# EasyEDA schematic EasyEDA_Source_v2.e.json
TITLE: Juego; REV: v2.d; Date: 2022.09; Sheet: 1/1; Drawn By: bryan costanich; Company: Wilderness Labs
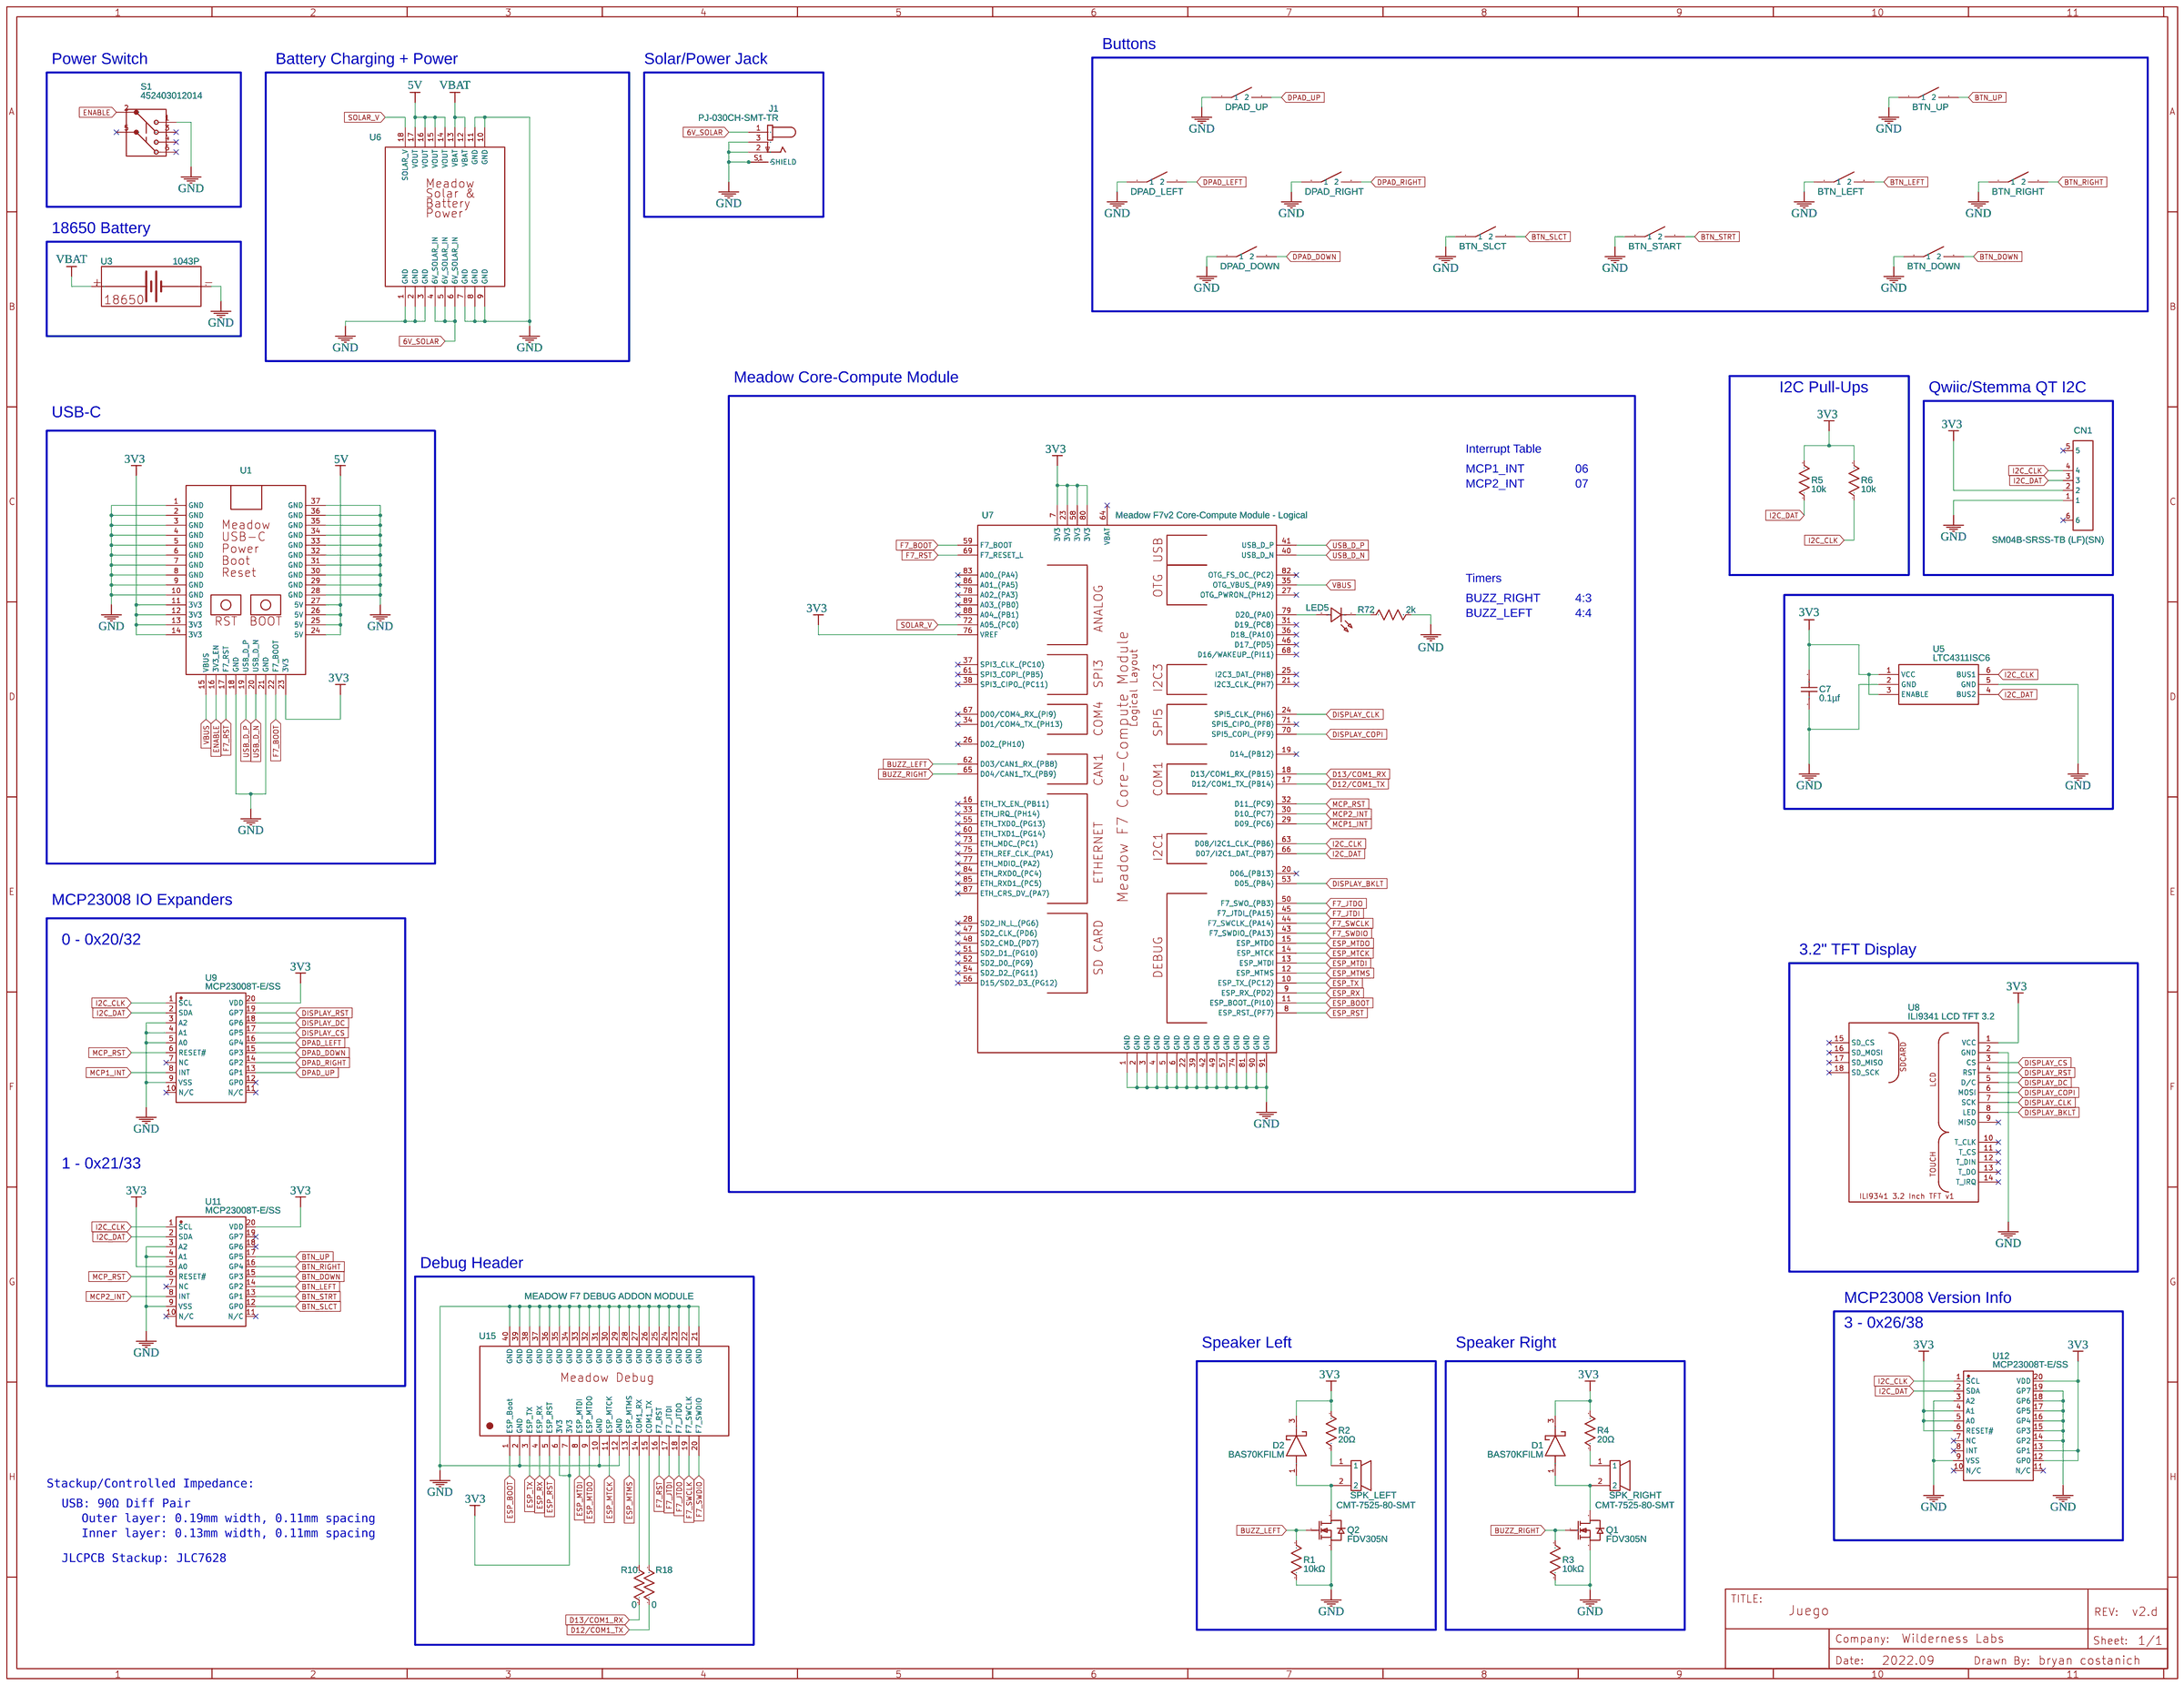
[diagram p0: schematic sheet]

## Parts
BTN_DOWN  Up  [TACTILE_SWITCH_TALL]
BTN_LEFT  Up  [TACTILE_SWITCH_TALL]
BTN_RIGHT  Up  [TACTILE_SWITCH_TALL]
BTN_SLCT  Up  [TACTILE_SWITCH_TALL]
BTN_START  Up  [TACTILE_SWITCH_TALL]
BTN_UP  Up  [TACTILE_SWITCH_TALL]
C7  0.1µf  [C0603]
CN1  SM04B-SRSS-TB (LF)(SN)  [CONN-SMD_4P-P1.00_SM04B-SRSS-TB-LF-SN]
D1  BAS70KFILM  [SOT323]
D2  BAS70KFILM  [SOT323]
DPAD_DOWN  Up  [TACTILE_SWITCH_TALL]
DPAD_LEFT  Up  [TACTILE_SWITCH_TALL]
DPAD_RIGHT  Up  [TACTILE_SWITCH_TALL]
DPAD_UP  Up  [TACTILE_SWITCH_TALL]
J1  PJ-030CH-SMT-TR  [CUI_PJ-030CH-SMT-TR]
LED5  EAST1608GA0  [LED0603-RD]
Q1  FDV305N  [SOT-23_L2.9-W1.3-P0.95-LS2.4-BR]
Q2  FDV305N  [SOT-23_L2.9-W1.3-P0.95-LS2.4-BR]
R1  10kΩ  [R0603]
R2  20Ω  [R0603]
R3  10kΩ  [R0603]
R4  20Ω  [R0603]
R5  10k  [R0603]
R6  10k  [R0603]
R10  0  [R0603]
R18  0  [R0603]
R72  2k  [R0603]
S1  452403012014  [452403012014]
SPK_LEFT  CMT-7525-80-SMT  [CMT-7525S]
SPK_RIGHT  CMT-7525-80-SMT  [CMT-7525S]
U1  Meadow Core-Compute USB-C, Power, Boot, and Reset Addon Module  [MEADOW CORE-COMPUTE USB-C, POWER, BOOT, RESET ADDON MODULE]
U3  1043P  [BAT-TH_KEYSTONE-1043P]
U5  LTC4311ISC6  [SC-70-6_L2.2-W1.3-P0.65-LS2.2-BL]
U6  Meadow Core-Compute Addon Module - Solar Battery Power  [MEADOW CORE-COMPUTE SOLAR & BATTERY POWER ADDON MODULE]
U7  Meadow F7v2 Core-Compute Module - Logical  [MEADOW_F7V2_CORE_COMPUTE]
U8  ILI9341 LCD TFT 3.2  [ILI9341 TFT LCD 3.2"]
U9  MCP23008T-E/SS  [SSOP-20_L7.2-W5.3-P0.65-LS7.8-TL]
U11  MCP23008T-E/SS  [SSOP-20_L7.2-W5.3-P0.65-LS7.8-TL]
U12  MCP23008T-E/SS  [SSOP-20_L7.2-W5.3-P0.65-LS7.8-TL]
U15  MEADOW F7 DEBUG ADDON MODULE  [MEADOW F7 DEBUG ADDON MODULE]

## Library data of the parts
BTN_DOWN BTN_LEFT BTN_RIGHT BTN_SLCT BTN_START BTN_UP DPAD_DOWN DPAD_LEFT DPAD_RIGHT DPAD_UP = Tactile Switch 6x6 SMD: Contributor: vietninh
C7 = CC0603KRX7R7BB104: Supplier: LCSC; Supplier Part: C108079; Manufacturer: YAGEO; Contributor: LCSC
CN1 = SM04B-SRSS-TB (LF)(SN): Supplier: LCSC; Supplier Part: C160404; Manufacturer: JST Sales America; Contributor: LCSC; JLCPCB Part Class: Extended Part
D1 D2 = BAS70KFILM: Contributor: quantum love; Manufacturer: ST Microelectronics
J1 = PJ-030CH-SMT-TR: Contributor: rbwilliams; Manufacturer: CUI Devices
LED5 = EAST1608GA0: Manufacturer: Everlight; Contributor: LCSC
Q1 Q2 = 2N7002: Manufacturer: Fairchild; Supplier Part: C65189; Contributor: LCEDA_Lib; Package Display: No
R1 R3 = R_0402_US: Contributor: LCEDA_Lib; Manufacturer Part: RC0603FR-0710KL; Manufacturer: Yageo
R2 R4 = R_0402_US: Contributor: LCEDA_Lib; Manufacturer Part: RC0603FR-0720RL; Manufacturer: Yageo
R5 R6 = Res_0603(1/10W)_US: Manufacturer Part: RC0603FR-0710KL; Manufacturer: Yageo
R10 R18 = R_0603_US: Contributor: LCEDA_Lib; Manufacturer Part: RC0603JR-070RL; Manufacturer: Yageo
R72 = R_0603_US: Contributor: LCEDA_Lib; Manufacturer Part: RC0603FR-072KL; Manufacturer: Yageo
S1 = 452403012014: WS-SLSV; Contributor: fsadrzad; Manufacturer: Wurth Elektronic
SPK_LEFT SPK_RIGHT = CMT-7525-80-SMT: Manufacturer: CUI Devices; Manufacturer Part: CMT-7525-80-SMT-TR; Contributor: bryanf
U1 = Meadow Core-Compute USB-C, Power, Boot, and Reset Addon Module: Manufacturer: Wilderness Labs; Contributor: bryan_6020
U3 = 1043P: Manufacturer: Keystone; Supplier: Digi-Key; link: https://www.keyelco.com/product.cfm/product_id/13958; Contributor: bryan_6020
U5 = LTC4311ISC6: Manufacturer Part: LTC4311ISC6#TRPBF; Contributor: Thomas_HUMZA
U6 = Meadow Core-Compute Addon Module - Solar Battery Power: Manufacturer: Wilderness Labs; Contributor: bryan_6020
U7 = Meadow F7v2 Core-Compute Module - Logical: Manufacturer: Wilderness Labs; link: https://www.wildernesslabs.co/hardware; Contributor: bryan_6020
U8 = ILI9341 LCD TFT 3.2: Contributor: Lutfito danuega
U9 U11 U12 = MCP23008T-E/SS: Supplier: LCSC; Supplier Part: C629435; Manufacturer: Microchip Tech; Contributor: LCSC
U15 = MEADOW F7 DEBUG ADDON MODULE: Contributor: bryan_6020

## Nets
3V3: C7.2 CN1.2 D1.3(K) D2.3(K) R2.2 R4.2 R5.2 R6.2 U1.11(3V3) U1.12(3V3) U1.13(3V3) U1.14(3V3) U1.23(3V3) U5.1(VCC) U5.3(ENABLE) U7.7(3V3) U7.23(3V3) U7.58(3V3) U7.76(VREF) U7.80(3V3) U8.1(VCC) U9.20(VDD) U11.5(A0) U11.20(VDD) U12.4(A1) U12.5(A0) U12.6(RESET#) U12.12(GP0) U12.13(GP1) U12.20(VDD) U15.6(3V3) U15.7(3V3)
5V: U1.24(5V) U1.25(5V) U1.26(5V) U1.27(5V) U6.14(VOUT) U6.15(VOUT) U6.16(VOUT) U6.17(VOUT)
6V_SOLAR: J1.1 U6.4(6V_SOLAR_IN) U6.5(6V_SOLAR_IN) U6.6(6V_SOLAR_IN)
GND: BTN_DOWN.A1(1) BTN_LEFT.A1(1) BTN_RIGHT.A1(1) BTN_SLCT.A1(1) BTN_START.A1(1) BTN_UP.A1(1) C7.1 CN1.1 DPAD_DOWN.A1(1) DPAD_LEFT.A1(1) DPAD_RIGHT.A1(1) DPAD_UP.A1(1) J1.2 J1.3 J1.S1(SHIELD) J1.S2(SHIELD) Q1.2(S) Q2.2(S) R1.1 R3.1 R72.2 S1.1 U1.1(GND) U1.2(GND) U1.3(GND) U1.4(GND) U1.5(GND) U1.6(GND) U1.7(GND) U1.8(GND) U1.9(GND) U1.10(GND) U1.18(GND) U1.21(GND) U1.28(GND) U1.29(GND) U1.30(GND) U1.31(GND) U1.32(GND) U1.33(GND) U1.34(GND) U1.35(GND) U1.36(GND) U1.37(GND) U3.2(-) U5.2(GND) U5.5(GND) U6.1(GND) U6.2(GND) U6.3(GND) U6.7(GND) U6.8(GND) U6.9(GND) U6.10(GND) U6.11(GND) U7.1(GND) U7.2(GND) U7.3(GND) U7.4(GND) U7.5(GND) U7.6(GND) U7.22(GND) U7.39(GND) U7.42(GND) U7.49(GND) U7.57(GND) U7.74(GND) U7.81(GND) U7.90(GND) U7.91(GND) U8.2(GND) U9.3(A2) U9.4(A1) U9.5(A0) U9.9(VSS) U11.3(A2) U11.4(A1) U11.9(VSS) U12.3(A2) U12.9(VSS) U12.14(GP2) U12.15(GP3) U12.16(GP4) U12.17(GP5) U12.18(GP6) U12.19(GP7) U15.2(GND) U15.10(GND) U15.12(GND) U15.21(GND) U15.22(GND) U15.23(GND) U15.24(GND) U15.25(GND) U15.26(GND) U15.27(GND) U15.28(GND) U15.29(GND) U15.30(GND) U15.31(GND) U15.32(GND) U15.33(GND) U15.34(GND) U15.35(GND) U15.36(GND) U15.37(GND) U15.38(GND) U15.39(GND) U15.40(GND)
VBAT: U3.1(+) U6.12(VBAT) U6.13(VBAT)
VBUS: U1.15(VBUS) U7.35(OTG_VBUS (PA9))
BTN_DOWN: BTN_DOWN.B1(2) U11.15(GP3)
BTN_LEFT: BTN_LEFT.B1(2) U11.14(GP2)
BTN_RIGHT: BTN_RIGHT.B1(2) U11.16(GP4)
BTN_SLCT: BTN_SLCT.B1(2) U11.12(GP0)
BTN_STRT: BTN_START.B1(2) U11.13(GP1)
BTN_UP: BTN_UP.B1(2) U11.17(GP5)
BUZZ_LEFT: Q2.1(G) R1.2 U7.62(D03/CAN1_RX (PB8))
BUZZ_RIGHT: Q1.1(G) R3.2 U7.65(D04/CAN1_TX (PB9))
D12/COM1_TX: R18.1 U7.17(D12/COM1_TX (PB14))
D13/COM1_RX: R10.1 U7.18(D13/COM1_RX (PB15))
DISPLAY_BKLT: U7.53(D05 (PB4)) U8.8(LED)
DISPLAY_CLK: U7.24(SPI5_CLK (PH6)) U8.7(SCK)
DISPLAY_COPI: U7.70(SPI5_COPI (PF9)) U8.6(MOSI)
DISPLAY_CS: U8.3(CS) U9.17(GP5)
DISPLAY_DC: U8.5(D/C) U9.18(GP6)
DISPLAY_RST: U8.4(RST) U9.19(GP7)
DPAD_DOWN: DPAD_DOWN.B1(2) U9.15(GP3)
DPAD_LEFT: DPAD_LEFT.B1(2) U9.16(GP4)
DPAD_RIGHT: DPAD_RIGHT.B1(2) U9.14(GP2)
DPAD_UP: DPAD_UP.B1(2) U9.13(GP1)
ENABLE: S1.2(1) U1.16(3V3_EN)
ESP_BOOT: U7.11(ESP_BOOT (PI10)) U15.1(ESP_Boot)
ESP_MTCK: U7.14(ESP_MTCK) U15.11(ESP_MTCK)
ESP_MTDI: U7.13(ESP_MTDI) U15.8(ESP_MTDI)
ESP_MTDO: U7.15(ESP_MTDO) U15.9(ESP_MTDO)
ESP_MTMS: U7.12(ESP_MTMS) U15.13(ESP_MTMS)
ESP_RST: U7.8(ESP_RST (PF7)) U15.5(ESP_RST)
ESP_RX: U7.9(ESP_RX (PD2)) U15.4(ESP_RX)
ESP_TX: U7.10(ESP_TX (PC12)) U15.3(ESP_TX)
F7_BOOT: U1.22(F7_BOOT) U7.59(F7_BOOT)
F7_JTDI: U7.45(F7_JTDI (PA15)) U15.17(F7_JTDI)
F7_JTDO: U7.50(F7_SWO (PB3)) U15.18(F7_JTDO)
F7_RST: U1.17(F7_RST) U7.69(F7_RESET_L) U15.16(F7_RST)
F7_SWCLK: U7.44(F7_SWCLK (PA14)) U15.19(F7_SWCLK)
F7_SWDIO: U7.43(F7_SWDIO (PA13)) U15.20(F7_SWDIO)
I2C_CLK: CN1.4 R6.1 U5.6(BUS1) U7.63(D08/I2C1_CLK (PB6)) U9.1(SCL) U11.1(SCL) U12.1(SCL)
I2C_DAT: CN1.3 R5.1 U5.4(BUS2) U7.66(D07/I2C1_DAT (PB7)) U9.2(SDA) U11.2(SDA) U12.2(SDA)
MCP1_INT: U7.29(D09 (PC6)) U9.8(INT)
MCP2_INT: U7.30(D10 (PC7)) U11.8(INT)
MCP_RST: U7.32(D11 (PC9)) U9.6(RESET#) U11.6(RESET#)
SOLAR_V: U6.18(SOLAR_V) U7.72(A05 (PC0))
USB_D_N: U1.20(USB_D_N) U7.40(USB_D_N)
USB_D_P: U1.19(USB_D_P) U7.41(USB_D_P)
Net-(D1-1): D1.1(A) Q1.3(D) SPK_RIGHT.2
Net-(D2-1): D2.1(A) Q2.3(D) SPK_LEFT.2
Net-(LED5-1): LED5.1(K) R72.1
Net-(LED5-2): LED5.2(A) U7.79(D20 (PA0))
Net-(R2-1): R2.1 SPK_LEFT.1
Net-(R4-1): R4.1 SPK_RIGHT.1
Net-(R10-2): R10.2 U15.14(COM1_RX)
Net-(R18-2): R18.2 U15.15(COM1_TX)

Not connected (* = marked no-connect by the designer): CN1 5* 6*; S1 3(1)* 4(1)* 5(2)* 6(1)*; U7 16(ETH_TX_EN (PB11))* 19(D14 (PB12))* 20(D06 (PB13))* 21(I2C3_CLK (PH7))* 25(I2C3_DAT (PH8))* 26(D02 (PH10))* 27(OTG_PWRON (PH12))* 28(SD2_IN_L (PG6))* 31(D19 (PC8))* 33(ETH_IRQ (PH14))* 34(D01/COM4_TX (PH13))* 36(D18 (PA10))* 37(SPI3_CLK (PC10))* 38(SPI3_CIPO (PC11))* 46(D17 (PD5))* 47(SD2_CLK (PD6))* 48(SD2_CMD (PD7))* 51(SD2_D1 (PG10))* 52(SD2_D0 (PG9))* 54(SD2_D2 (PG11))* 55(ETH_TXD0 (PG13))* 56(D15/SD2_D3 (PG12))* 60(ETH_TXD1 (PG14))* 61(SPI3_COPI (PB5))* 64(VBAT)* 67(D00/COM4_RX (PI9))* 68(D16/WAKEUP (PI11))* 71(SPI5_CIPO (PF8))* 73(ETH_MDC (PC1))* 75(ETH_REF_CLK (PA1))* 77(ETH_MDIO (PA2))* 78(A02 (PA3))* 82(OTG_FS_OC (PC2))* 83(A00 (PA4))* 84(ETH_RXD0 (PC4))* 85(ETH_RXD1 (PC5))* 86(A01 (PA5))* 87(ETH_CRS_DV (PA7))* 88(A04 (PB1))* 89(A03 (PB0))*; U8 9(MISO)* 10(T_CLK)* 11(T_CS)* 12(T_DIN)* 13(T_DO)* 14(T_IRQ)* 15(SD_CS)* 16(SD_MOSI)* 17(SD_MISO)* 18(SD_SCK)*; U9 7(NC)* 10(N/C)* 11(N/C)* 12(GP0)*; U11 7(NC)* 10(N/C)* 11(N/C)* 18(GP6)* 19(GP7)*; U12 7(NC)* 8(INT)* 10(N/C)* 11(N/C)*

## Notes on the sheet
- Buttons
- Power Switch
- Battery Charging + Power
- Solar/Power Jack
- 18650 Battery
- Meadow Core-Compute Module
- I2C Pull-Ups
- Qwiic/Stemma QT I2C
- USB-C
- Interrupt Table
- MCP1_INT
- 06
- MCP2_INT
- 07
- Timers
- BUZZ_RIGHT
- 4:3
- BUZZ_LEFT
- 4:4
- MCP23008 IO Expanders
- 0 - 0x20/32
- 3.2" TFT Display
- 1 - 0x21/33
- Debug Header
- MCP23008 Version Info
- 3 - 0x26/38
- Speaker Left
- Speaker Right
- Stackup/Controlled Impedance:
- USB: 90Ω Diff Pair
- Outer layer: 0.19mm width, 0.11mm spacing
- Inner layer: 0.13mm width, 0.11mm spacing
- JLCPCB Stackup: JLC7628
